# Altium schematic sheet ledSequencer.SchDoc: LED Sequencer
size A4; Date: 30/04/2023; CheckedBy: OK; Engineer: vsubas; Revision: 01; SheetNumber: 1; SheetTotal: 1
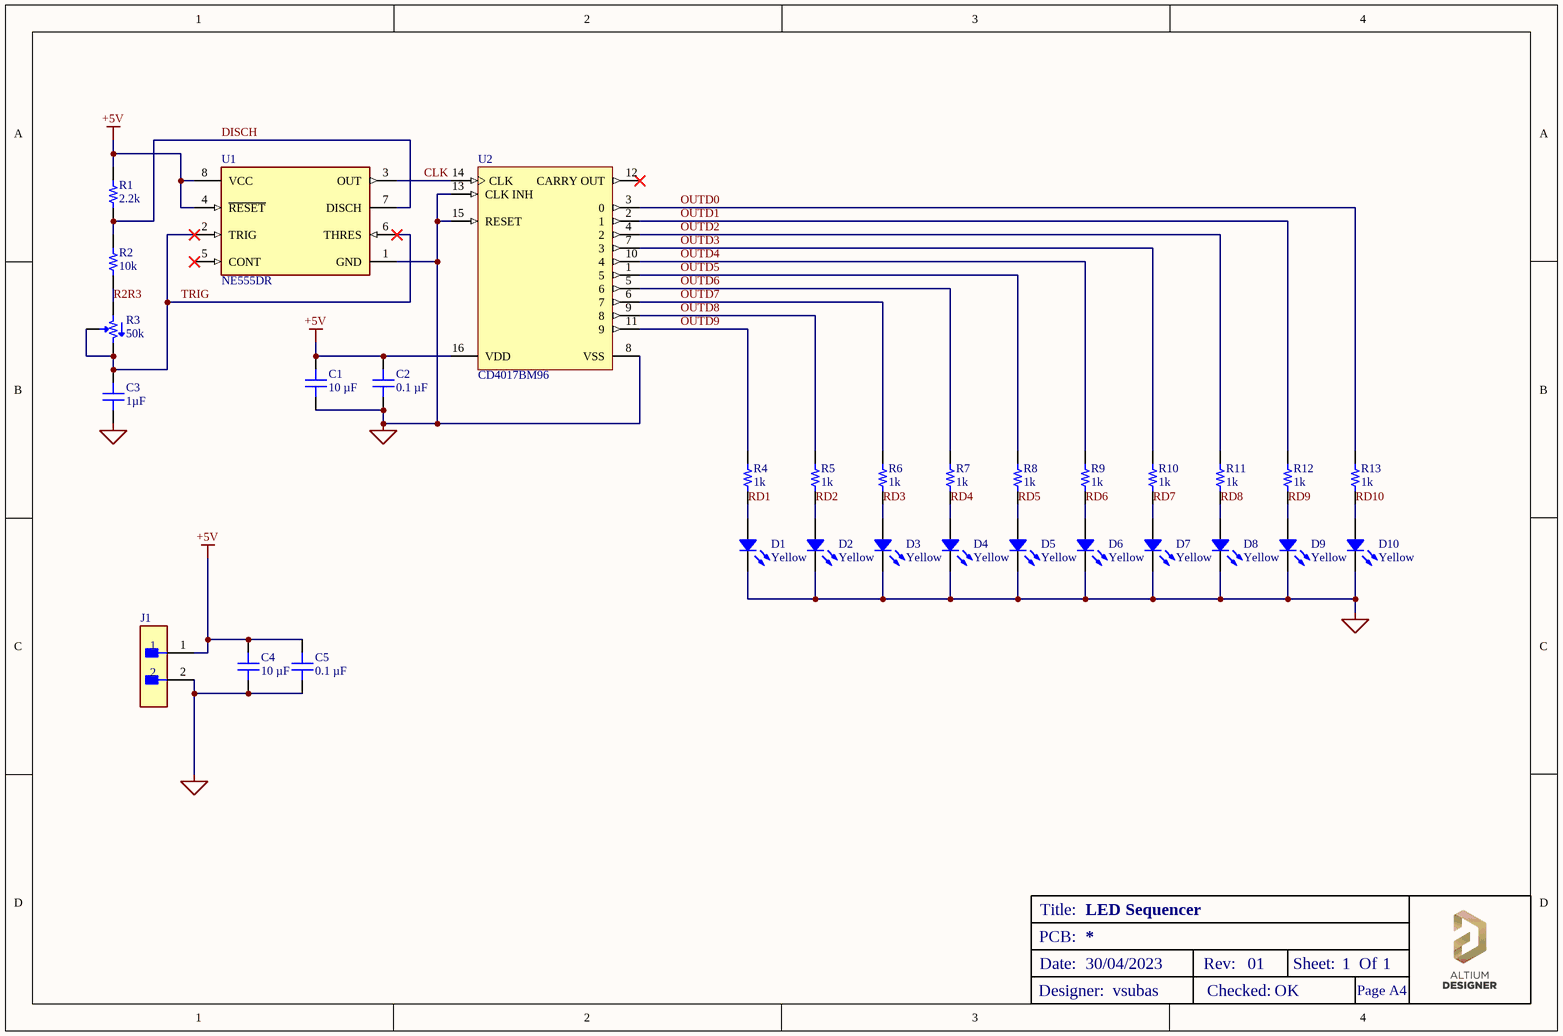
[diagram p0: ledSequencer.SchDoc]

## Parts
C1  10 µF  [CAP 0805_2012]
C2  0.1 µF  [CAP 0805_2012]
C3  1µF  [CAP 0805_2012]
C4  10 µF  [CAP 0805_2012]
C5  0.1 µF  [CAP 0805_2012]
D1  Yellow  [LED 0805_2012 YELLOW]
D2  Yellow  [LED 0805_2012 YELLOW]
D3  Yellow  [LED 0805_2012 YELLOW]
D4  Yellow  [LED 0805_2012 YELLOW]
D5  Yellow  [LED 0805_2012 YELLOW]
D6  Yellow  [LED 0805_2012 YELLOW]
D7  Yellow  [LED 0805_2012 YELLOW]
D8  Yellow  [LED 0805_2012 YELLOW]
D9  Yellow  [LED 0805_2012 YELLOW]
D10  Yellow  [LED 0805_2012 YELLOW]
J1  M20-9990245  [FP-M20-9990245-MFG]  (value not drawn)
R1  2.2k  [RES 0805_2012]
R2  10k  [RES 0805_2012]
R3  50k  [BOURNS TRIMPOT 3386P-1]
R4  1k  [RES 0805_2012]
R5  1k  [RES 0805_2012]
R6  1k  [RES 0805_2012]
R7  1k  [RES 0805_2012]
R8  1k  [RES 0805_2012]
R9  1k  [RES 0805_2012]
R10  1k  [RES 0805_2012]
R11  1k  [RES 0805_2012]
R12  1k  [RES 0805_2012]
R13  1k  [RES 0805_2012]
U1  NE555DR  [FP-D0008A-IPC_A]
U2  CD4017BM96  [D0016A_L]

## Nets
+5V: C1.2 C2.2 C4.2 C5.2 J1.1 R1.2 U1.4(~{RESET}) U1.8(VCC) U2.16(VDD)
GND: C1.1 C2.1 C3.1 C4.1 C5.1 D1.2 D2.2 D3.2 D4.2 D5.2 D6.2 D7.2 D8.2 D9.2 D10.2 J1.2 U1.1(GND) U2.8(VSS) U2.13(CLK_INH) U2.15(RESET)
CLK: U1.3(OUT) U2.14(CLK)
DISCH: R1.1 R2.2 U1.7(DISCH)
OUTD0: R13.1 U2.3(0)
OUTD1: R12.1 U2.2(1)
OUTD2: R11.1 U2.4(2)
OUTD3: R10.1 U2.7(3)
OUTD4: R9.1 U2.10(4)
OUTD5: R8.1 U2.1(5)
OUTD6: R7.1 U2.5(6)
OUTD7: R6.1 U2.6(7)
OUTD8: R5.1 U2.9(8)
OUTD9: R4.1 U2.11(9)
R2R3: R2.1 R3.1
RD1: D1.1 R4.2
RD2: D2.1 R5.2
RD3: D3.1 R6.2
RD4: D4.1 R7.2
RD5: D5.1 R8.2
RD6: D6.1 R9.2
RD7: D7.1 R10.2
RD8: D8.1 R11.2
RD9: D9.1 R12.2
RD10: D10.1 R13.2
TRIG: C3.2 R3.2 R3.3 U1.2(TRIG) U1.6(THRES)

Not connected (* = marked no-connect by the designer): U1 5(CONT)*; U2 12(CARRY_OUT)*

## Notes on the sheet
- Title:
- Date:
- PCB:
- Designer:
- Checked:
- Rev:
- Sheet:
- Of
- Page A4

## Library data of the parts
C1 C4 = C2012X5R1E106K125AB: CAP CER 10UF 25V X5R 0805; manufacturer: TDK Corporation; Tolerance: ±10%; Part Number: C2012X5R1E106K125AB; Value: 10 µF; Applications: General Purpose; Capacitance: 10 µF; componentlink1description: Datasheet; componentlink1url: https://product.tdk.com/info/en/catalog/datasheets/mlcc_commercial_general_en.pdf?ref_disty=digikey; componentlink2description: DigiKey Link; componentlink2url: https://www.digikey.com/en/products/detail/tdk-corporation/C2012X5R1E106K125AB/2443462; Device Package: 0805 (2012 Metric); Features: Low ESL; lastupdated: 29/04/2023 7:14:18 PM; Lifecycle Status: Active; Minimum Order: 1; Mounting Type: Surface Mount, MLCC; Operating Temperature: -55°C ~ 85°C; Package / Case: 0805 (2012 Metric); packaging: TapeAndReel; partid: 4850; Part Status: Active; price: 0.06; series: C; Size / Dimension: 0.079" L x 0.049" W (2.00mm x 1.25mm); Supplier 1: DigiKey; Supplier Part Number 1: 445-5984-1-ND; Temperature Coefficient: X5R; Thickness (Max): 0.057" (1.45mm); Voltage - Rated: 25V
C2 C5 = CC0805MRX7R9BB104: CAP CER 0.1UF 50V X7R 0805; manufacturer: Yageo; Tolerance: ±20%; Part Number: CC0805MRX7R9BB104; Value: 0.1 µF; Applications: General Purpose; Capacitance: 0.1 µF; componentlink1description: Datasheet; componentlink1url: https://www.yageo.com/upload/media/product/productsearch/datasheet/mlcc/UPY-GPHC_X7R_6.3V-to-50V_18.pdf; componentlink2description: DigiKey Link; componentlink2url: https://www.digikey.com/en/products/detail/yageo/CC0805MRX7R9BB104/5884281; Device Package: 0805 (2012 Metric); lastupdated: 29/04/2023 7:14:25 PM; Lifecycle Status: Active; Minimum Order: 1; Mounting Type: Surface Mount, MLCC; Operating Temperature: -55°C ~ 125°C; Package / Case: 0805 (2012 Metric); packaging: TapeAndReel; partid: 2475; Part Status: Active; price: 0.01; series: CC; Size / Dimension: 0.079" L x 0.049" W (2.00mm x 1.25mm); Supplier 1: DigiKey; Supplier Part Number 1: 311-4351-1-ND; Temperature Coefficient: X7R; Thickness (Max): 0.037" (0.95mm); Voltage - Rated: 50V
C3 = MM05ZC105KCZ2A: CAP CER 1UF 10V X7R 0805; manufacturer: AVX Corporation; Tolerance: ±10%; Part Number: MM05ZC105KCZ2A; Value: 1µF; Applications: Medical, Non-Critical; Capacitance: 1µF; componentlink1description: Datasheet; componentlink1url: http://datasheets.avx.com/AVX-MM.pdf; componentlink2description: DigiKey Link; componentlink2url: http://digikey.com/product-detail/en/avx-corporation/MM05ZC105KCZ2A/478-10611-1-ND/7344872; Device Package: 0805 (2012 Metric); lastupdated: 2/09/2020 1:04:42 AM; Lifecycle Status: Active; Minimum Order: 1; Mounting Type: Surface Mount, MLCC; Operating Temperature: -55°C ~ 125°C; Package / Case: 0805 (2012 Metric); packaging: TapeAndReel; partid: 2439; Part Status: Active; price: 0.50; series: MM; Size / Dimension: 0.079" L x 0.049" W (2.01mm x 1.25mm); Supplier 1: DigiKey; Supplier Part Number 1: 478-10611-1-ND; Temperature Coefficient: X7R; Thickness (Max): 0.029" (0.74mm); Voltage - Rated: 10V
D1-D10 = 5988140107F: LED YELLOW CLEAR 0805 SMD; Manufacturer: Dialight; Configuration: Standard; Current - Test: 20mA; Lens Color: Colorless; Lens Size: 1.40mm x 1.25mm; Lens Style: Rectangle with Flat Top; Millicandela Rating: 130mcd; Viewing Angle: 140°; Voltage - Forward (Vf) (Typ): 2V; Wavelength - Dominant: 593nm; Part Number: 5988140107F; Color: Yellow; ComponentLink1Description: Datasheet; ComponentLink1URL: //media.digikey.com/pdf/Data%20Sheets/Dialight%20PDFs/598_Series_0805_Pkg.pdf; ComponentLink2Description: DigiKey Link; ComponentLink2URL: https://www.digikey.com/en/products/detail/dialight/5988140107F/1291275; Device Package: 0805 (2012 Metric); Height (Max): 0.80mm; LastUpdated: 29/04/2023 8:08:57 PM; Lens Transparency: Clear; Lifecycle Status: Active; Minimum Order: 1; Mounting Type: Surface Mount; Package / Case: 0805 (2012 Metric); Packaging: TapeAndReel; PartId: 48; Part Status: Active; Price: 0.05; Series: 598; Size / Dimension: 2.00mm L x 1.25mm W; Supplier 1: DigiKey; Supplier Part Number 1: 350-2041-1-ND; Supplier Device Package: 0805; Value: Yellow
J1 = CMP-15831-000105-1: CONN HEADER VERT 2POS 2.54MM; Working Voltage: 750V; Gender: Male; Number of Poles: 2; Current Rating: 3A; Mated Stacking Heights: 16.54mm; Contact Resistance: 25mR; Connector Type: Male Pin; Insulation Resistance: 10GR; Mating Cycles: 300; Voltage: 50V; Flammability Rating: UL94 V-0; Pitch: 2.54mm; Series: M20; Number of Contacts: 2; Height: 0.12inch; Min Operating Temperature: -40°C; Contact Finish - Mating: GOLD; Number of Positions: 2; Number of Rows: 1; Packaging: Bulk; Package Quantity: 1000; Voltage Rating (AC): 750V; Current: 3A; Mount: Through Hole; Case/Package: SIL; Orientation: Straight; Contact Shape: Square; Weight: 0.25lb; Radiation Hardening: No; Fastening Type: Pull; Length: 5.08mm; Depth: 2.54mm; Contact Mating Length: 0.24inch; Housing Material: Nylon; Reach SVHC Compliant: Yes; Insulation Material: Nylon; Color: Black; Width: 0.25inch; Insulation Color: Black; Contact Material: Brass; Contact Type: Male Pin; Termination: Solder; Max Operating Temperature: 105°C; Contact Plating: Gold; Housing Color: Black; Max Current Rating: 3A; Lead Pitch: 2.54mm
R1 = SR0805JR-7W2K2L: RES 2.2K OHM 5% 1/4W 0805; Manufacturer: Yageo; Power (Watts): 0.25W, 1/4W; Temperature Coefficient: ±100ppm/°C; Part Number: SR0805JR-7W2K2L; Value: 2.2k; ComponentLink1Description: Datasheet; ComponentLink1URL: http://www.yageo.com/documents/recent/PYu-SR_20105_RoHS_L_8.pdf; ComponentLink2Description: DigiKey Link; ComponentLink2URL: https://www.digikey.com/en/products/detail/yageo/SR0805JR-7W2K2L/5948720; Composition: Thick Film; Device Package: 0805 (2012 Metric); Features: Automotive AEC-Q200, Pulse Withstanding; Height - Seated (Max): 0.024" (0.60mm); LastUpdated: 29/04/2023 7:52:18 PM; Lifecycle Status: Active; Minimum Order: 1; Number of Terminations: 2; Operating Temperature: -55°C ~ 155°C; Package / Case: 0805 (2012 Metric); Packaging: TapeAndReel; PartId: 27793; Part Status: Active; Price: 0.02; Ratings: AEC-Q200; Resistance: 2.2k; Series: SR; Size / Dimension: 0.079" L x 0.049" W (2.00mm x 1.25mm); Supplier 1: DigiKey; Supplier Part Number 1: YAG6054CT-ND; Supplier Device Package: 0805; Tolerance: ±5%
R2 = RNCS0805BKE10K0: RES 10K OHM 0.1% 1/10W 0805; Manufacturer: Stackpole Electronics Inc; Power (Watts): 0.1W, 1/10W; Temperature Coefficient: ±25ppm/°C; Part Number: RNCS0805BKE10K0; Value: 10k; ComponentLink1Description: Datasheet; ComponentLink1URL: https://www.seielect.com/catalog/sei-rncs_rnch.pdf; ComponentLink2Description: DigiKey Link; ComponentLink2URL: https://www.digikey.com/en/products/detail/stackpole-electronics-inc/RNCS0805BKE10K0/1800067; Composition: Thin Film; Device Package: 0805 (2012 Metric); Features: Anti-Corrosive, Automotive AEC-Q200, Moisture Resistant; Height - Seated (Max): 0.026" (0.65mm); LastUpdated: 29/04/2023 7:52:18 PM; Lifecycle Status: Active; Minimum Order: 1; Number of Terminations: 2; Operating Temperature: -55°C ~ 155°C; Package / Case: 0805 (2012 Metric); Packaging: TapeAndReel; PartId: 27713; Part Status: Active; Price: 0.07; Ratings: AEC-Q200; Resistance: 10k; Series: RNCS; Size / Dimension: 0.079" L x 0.049" W (2.00mm x 1.25mm); Supplier 1: DigiKey; Supplier Part Number 1: RNCS0805BKE10K0CT-ND; Supplier Device Package: 0805; Tolerance: ±0.1%
R3 = 3386P-1-503: TRIMMER 50K OHM 0.5W PC PIN TOP; Manufacturer: Bourns Inc.; Adjustment Type: Top Adjustment; Number of Turns: 1; Power (Watts): 0.5W, 1/2W; Resistive Material: Cermet; Temperature Coefficient: ±100ppm/°C; Tolerance: ±10%; Part Number: 3386P-1-503; ComponentLink1Description: Datasheet; ComponentLink1URL: https://www.bourns.com/docs/Product-Datasheets/3386.pdf; ComponentLink2Description: DigiKey Link; ComponentLink2URL: https://www.digikey.com/en/products/detail/bourns-inc/3386P-1-503/86812; LastUpdated: 29/04/2023 8:27:50 PM; Lifecycle Status: Active; Minimum Order: 1; Mounting Type: Through Hole; Packaging: Tube; PartId: 123; Part Status: Active; Price: 1.18; Resistance: 50k; Series: Trimpot® 3386 - Sealed; Size / Dimension: Square - 0.375" x 0.375" Face (9.53mm x 9.53mm); Supplier 1: DigiKey; Supplier Part Number 1: 3386P-503-ND; Termination Style: PC Pins; Value: 50k
R4-R13 = RNCS0805BKE1K00: RES 1K OHM 0.1% 1/10W 0805; Manufacturer: Stackpole Electronics Inc; Power (Watts): 0.1W, 1/10W; Temperature Coefficient: ±25ppm/°C; Part Number: RNCS0805BKE1K00; Value: 1k; ComponentLink1Description: Datasheet; ComponentLink1URL: https://www.seielect.com/catalog/sei-rncs_rnch.pdf; ComponentLink2Description: DigiKey Link; ComponentLink2URL: https://www.digikey.com/en/products/detail/stackpole-electronics-inc/RNCS0805BKE1K00/1800073; Composition: Thin Film; Device Package: 0805 (2012 Metric); Features: Anti-Corrosive, Automotive AEC-Q200, Moisture Resistant; Height - Seated (Max): 0.026" (0.65mm); LastUpdated: 29/04/2023 7:52:18 PM; Lifecycle Status: Active; Minimum Order: 1; Number of Terminations: 2; Operating Temperature: -55°C ~ 155°C; Package / Case: 0805 (2012 Metric); Packaging: TapeAndReel; PartId: 27715; Part Status: Active; Price: 0.07; Ratings: AEC-Q200; Resistance: 1k; Series: RNCS; Size / Dimension: 0.079" L x 0.049" W (2.00mm x 1.25mm); Supplier 1: DigiKey; Supplier Part Number 1: RNCS0805BKE1K00CT-ND; Supplier Device Package: 0805; Tolerance: ±0.1%
U1 = CMP-1685-00007-2: IC OSC SGL TIMER 100KHZ 8-SOIC; Low Level Output Current: 200mA; Quiescent Current: 15mA; Min Supply Voltage: 4.5V; Number of Timers/Counters: 1; Max Supply Voltage: 16V; Operating Supply Current: 10mA; High Level Output Current: -200mA; Packaging: Tape and Reel; Frequency: 100kHz; Weight: 0.002561oz; REACH SVHC: No SVHC; Package Quantity: 2500; Width: 3.91mm; Max Operating Temperature: 70°C; Contact Plating: Gold; Lead Free: Lead Free; Number of Pins: 8; Min Operating Temperature: 0°C; Radiation Hardening: No; Length: 4.9mm; Case/Package: SOIC; Height: 1.58mm; Mount: Surface Mount
U2 = CMP-1623-00072-2: CMOS Decade Counter with 10 Decoded Outputs, D0016A, LARGE T&R; Manufacturer: Texas Instruments; Technology Family: CD4000; Schmitt Trigger: No; VCC(Max)(V): 18; Inputs: 1; tpd @ Nom Voltage(Max)(ns): 270; Rating: Military; Bits(#): 10; Output Drive (IOL/IOH)(Max)(mA): 1.5/-1.5; ICC @ Nom Voltage(Max)(mA): 0.03; F @ Nom Voltage(Max)(Mhz): 8; VCC(Min)(V): 3; Output Type: CMOS; Operating Temperature Range(C): -55 to 125; Generic Part Number: CD4017B; Type: Decade; DatasheetVersion: SCHS027C; Input Type: CMOS; Function: Counter; PackageReference: D0016A; Code_JEDEC: MS-012 variation AC; Voltage(Nom)(V): 10